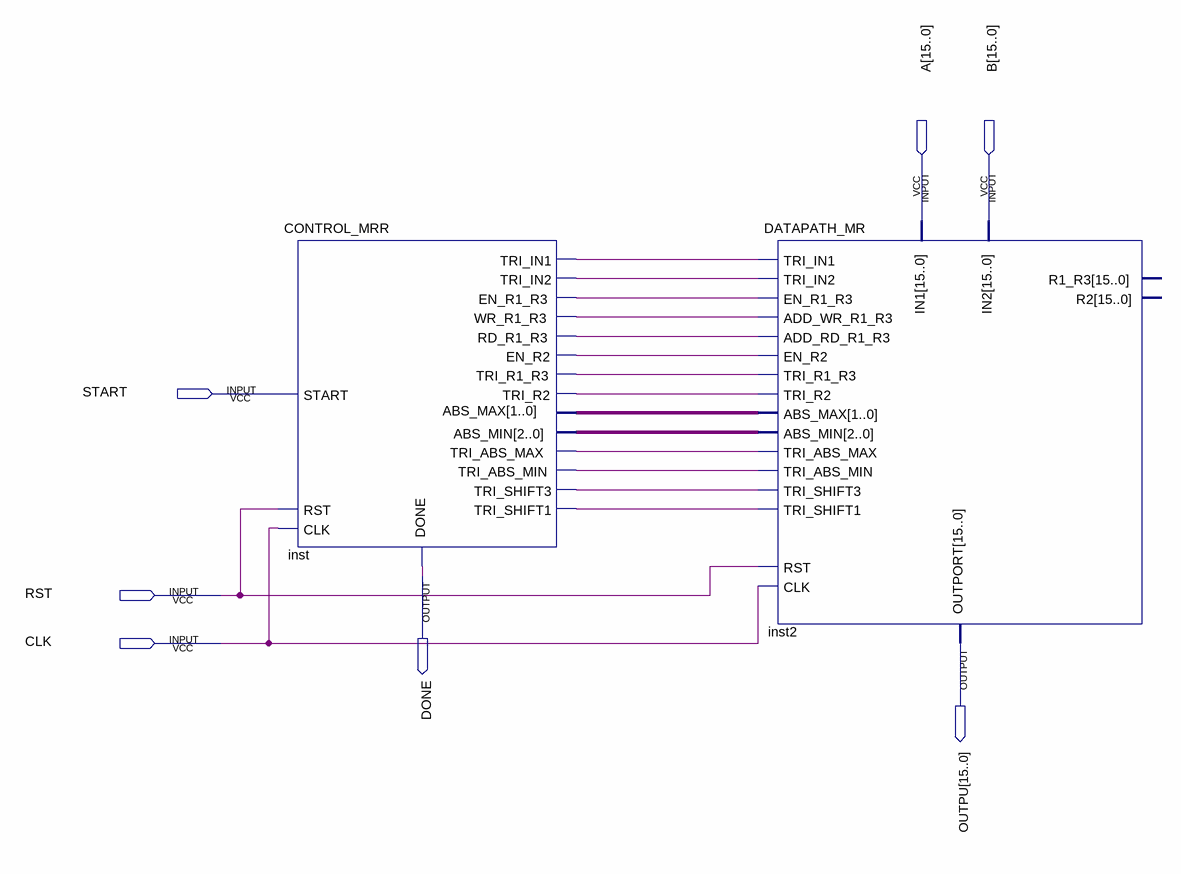
[diagram p0: schematic sheet]
// Quartus schematic SRA_MR.bdf as structural Verilog: 2 symbols, 7 pins
module SRA_MR (
  input  [15:0] A,
  input  [15:0] B,
  input  START,
  input  RST,
  input  CLK,
  output DONE,
  output [15:0] OUTPU
);

  wire inst_en_r1_r3, inst_en_r2, inst_rd_r1_r3, inst_tri_abs_max, inst_tri_abs_min, inst_tri_in1,
       inst_tri_in2, inst_tri_r1_r3, inst_tri_r2, inst_tri_shift1, inst_tri_shift3, inst_wr_r1_r3;
  wire [1:0] inst_abs_max;
  wire [2:0] inst_abs_min;

  CONTROL_MRR inst (
    .START(START), .CLK(CLK), .RST(RST), .TRI_IN1(inst_tri_in1), .TRI_IN2(inst_tri_in2),
    .EN_R1_R3(inst_en_r1_r3), .WR_R1_R3(inst_wr_r1_r3), .RD_R1_R3(inst_rd_r1_r3), .EN_R2(inst_en_r2),
    .ABS_MAX(inst_abs_max), .TRI_R1_R3(inst_tri_r1_r3), .TRI_R2(inst_tri_r2), .ABS_MIN(inst_abs_min),
    .TRI_ABS_MAX(inst_tri_abs_max), .TRI_ABS_MIN(inst_tri_abs_min), .TRI_SHIFT3(inst_tri_shift3),
    .TRI_SHIFT1(inst_tri_shift1), .DONE(DONE));
  DATAPATH_MR inst2 (
    .TRI_IN1(inst_tri_in1), .TRI_IN2(inst_tri_in2), .EN_R1_R3(inst_en_r1_r3), .ADD_WR_R1_R3(inst_wr_r1_r3),
    .ADD_RD_R1_R3(inst_rd_r1_r3), .EN_R2(inst_en_r2), .TRI_R1_R3(inst_tri_r1_r3), .TRI_R2(inst_tri_r2),
    .ABS_MAX(inst_abs_max), .ABS_MIN(inst_abs_min), .TRI_ABS_MAX(inst_tri_abs_max),
    .TRI_ABS_MIN(inst_tri_abs_min), .TRI_SHIFT3(inst_tri_shift3), .TRI_SHIFT1(inst_tri_shift1), .IN1(A),
    .IN2(B), .RST(RST), .CLK(CLK), .OUTPORT(OUTPU));  // open: R1_R3, R2
endmodule
